# EAGLE schematic with_boost (EAGLE 6.4)
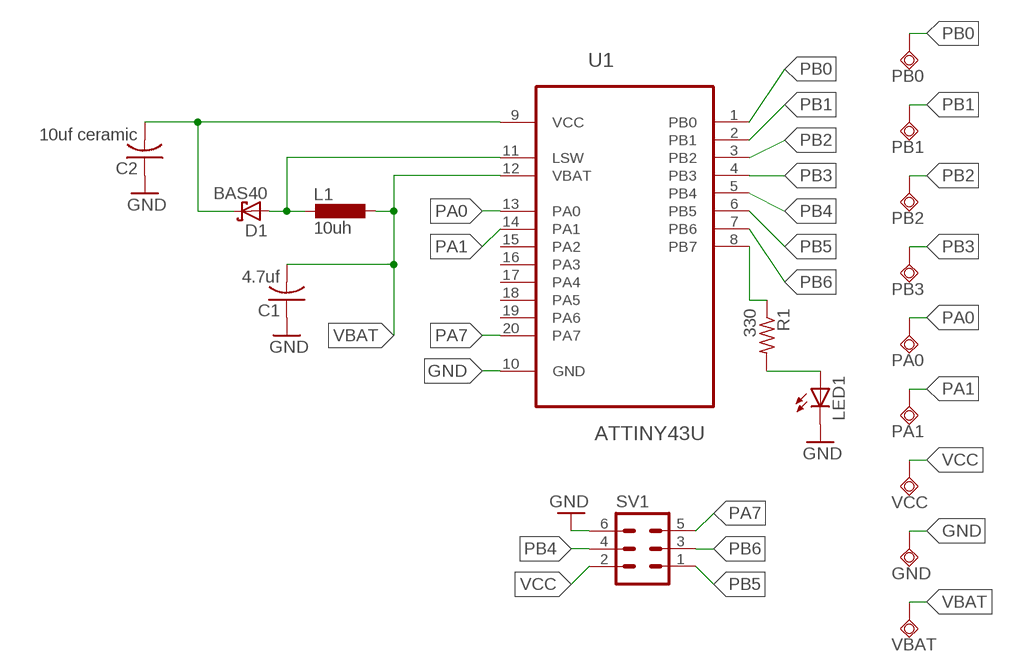
[diagram p0: schematic, sheet 1]

## Parts
C1  4.7uf  C-USC1206K  [C1206K]
C2  10uf ceramic  C-USC1206K  [C1206K]
D1  BAS40  [SOT23]
GND  TPSQTP20SQ  [TP20SQ]
L1  10uh  L-EUL3225M  [L3225M]
LED1  LEDCHIPLED_1206  [CHIPLED_1206]
PA0  TPSQTP20SQ  [TP20SQ]
PA1  TPSQTP20SQ  [TP20SQ]
PB0  TPSQTP20SQ  [TP20SQ]
PB1  TPSQTP20SQ  [TP20SQ]
PB2  TPSQTP20SQ  [TP20SQ]
PB3  TPSQTP20SQ  [TP20SQ]
R1  330  R-US_M1206  [M1206]
SV1  MA03-2  [MA03-2]
U1  ATTINY43U  ATTINY43U-SU  [SOIC127P1032X265-20N]
VBAT  TPSQTP20SQ  [TP20SQ]
VCC  TPSQTP20SQ  [TP20SQ]

## Nets
GND: C1.1 C2.1 GND.TP LED1.C SV1.6 U1.10(GND)
N$1: LED1.A R1.2
N$2: D1.1(A) L1.2 U1.11(LSW)
N$3: R1.1 U1.8(PB7)
PA0: PA0.TP U1.13(PA0)
PA1: PA1.TP U1.14(PA1)
PA7: SV1.5 U1.20(PA7)
PB0: PB0.TP U1.1(PB0)
PB1: PB1.TP U1.2(PB1)
PB2: PB2.TP U1.3(PB2)
PB3: PB3.TP U1.4(PB3)
PB4: SV1.4 U1.5(PB4)
PB5: SV1.1 U1.6(PB5)
PB6: SV1.3 U1.7(PB6)
VBAT: C1.2 L1.1 U1.12(VBAT) VBAT.TP
VCC: C2.2 D1.3(C) SV1.2 U1.9(VCC) VCC.TP
Unconnected: U1.15(PA2) U1.16(PA3) U1.17(PA4) U1.18(PA5) U1.19(PA6)

## Library data of the parts
C1 C2 = adafruit:C-US: CAPACITOR, American symbol
D1 = diode:BAS40: Silicon Schottky Diodes General-purpose diode for high-speed switching
GND PA0 PA1 PB0 PB1-PB3 VBAT VCC = testpad:TPSQ: Test pad
L1 = resistor:L-EU: INDUCTOR, European symbol
LED1 = adafruit:LED: LED OSRAM: - CHIPLED LG R971, LG N971, LY N971, LG Q971, LY Q971, LO R971, LY R971 LH N974, LH R974 LS Q976, LO Q976, LY Q976 LO Q996 - Hyper CHIPLED LW Q18S LB Q993, LB Q99A, LB R99A - SideLED LS A670, LO A670, LY A670, LG A670, LP A670 LB A673, LV A673, LT A673, LW A673 LH A674 LY A675 LS A676, LA A676, LO A676, LY A676, LW A676 LS A679, LY A679, LG A679 - Hyper Micro SIDELED® LS Y876, LA Y876, LO Y876, LY Y876 LT Y87S - SmartLED LW L88C, LW L88S LB L89C, LB L89S, LG L890 LS L89K, LO L89K, LY L89K LS L896, LA L896, LO L896, LY L896 - TOPLED LS T670, LO T670, LY T670, LG T670, LP T670 LSG T670, LSP T670, LSY T670, LOP T670, LYG T670 LG T671, LOG T671, LSG T671 LB T673, LV T673, LT T673, LW T673 LH T674 LS T676, LA T676, LO T676, LY T676, LB T676, LH T676, LSB T676, LW T676 LB T67C, LV T67C, LT T67C, LS T67K, LO T67K, LY T67K, LW E67C LS E67B, LA E67B, LO E67B, LY E67B, LB E67C, LV E67C, LT E67C LW T67C LS T679, LY T679, LG T679 LS T770, LO T770, LY T770, LG T770, LP T770 LB T773, LV T773, LT T773, LW T773 LH T774 LS E675, LA E675, LY E675, LS T675 LS T776, LA T776, LO T776, LY T776, LB T776 LHGB T686 LT T68C, LB T68C - Hyper Mini TOPLED® LB M676 - Mini TOPLED Santana® LG M470 LS M47K, LO M47K, LY M47K Source: http://www.osram.convergy.de/
R1 = adafruit:R-US_: RESISTOR, American symbol
SV1 = con-lstb:MA03-2: PIN HEADER; OC_FARNELL: unknown; OC_NEWARK: unknown
U1 = Atmel_By_element14_Batch_1:ATTINY43U-SU: 8-bit Microcontroller with In-System Programmable Flash and Boost Converter; MPN: ATTINY43U-SU; OC_FARNELL: 1841623; OC_NEWARK: 12T1338; PACKAGE: SOIC-20; SUPPLIER: Atmel